# Altium schematic sheet CAP TCH 4xBUT CY8CMBR2044.SchDoc
size 129 x 100 mm
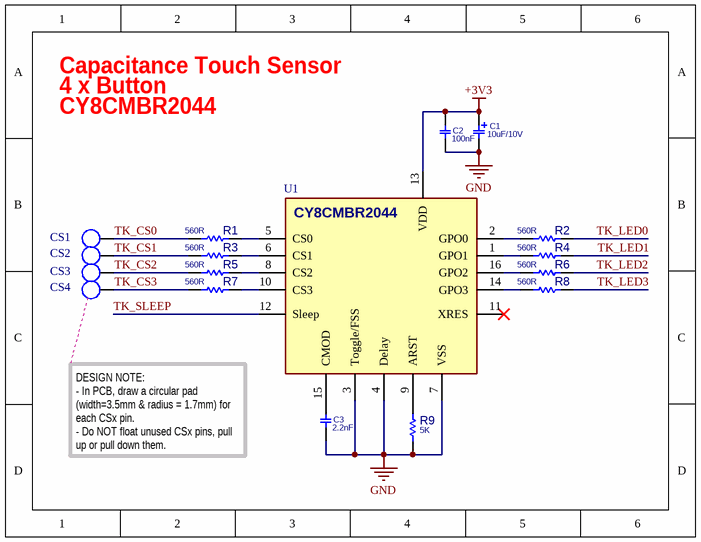
[diagram p0: CAP TCH 4xBUT CY8CMBR2044.SchDoc]

## Parts
C1  10uF/10V  [C_TN_3216]
C2  100nF  [C0603]
C3  2.2nF  [C0603]
CS1  CAP Sense  [CAP Sense 7mm]  (value not drawn)
CS2  CAP Sense  [CAP Sense 7mm]  (value not drawn)
CS3  CAP Sense  [CAP Sense 7mm]  (value not drawn)
CS4  CAP Sense  [CAP Sense 7mm]  (value not drawn)
R1  560R  [R0603]
R2  560R  [R0603]
R3  560R  [R0603]
R4  560R  [R0603]
R5  560R  [R0603]
R6  560R  [R0603]
R7  560R  [R0603]
R8  560R  [R0603]
R9  5K  [R0603]
U1  CY8CMBR2044  [QFN50_16T_3X3]  (value not drawn)

## Nets
+3V3: C1.1 C2.2 U1.13(VDD)
GND: C1.2 C2.1 C3.1 R9.1 U1.3(Toggle/FSS) U1.4(Delay) U1.7(VSS)
TK_CS0: CS1.1 R1.1
TK_CS1: CS2.1 R3.1
TK_CS2: CS3.1 R5.1
TK_CS3: CS4.1 R7.1
TK_LED0: R2.2
TK_LED1: R4.2
TK_LED2: R6.2
TK_LED3: R8.2
TK_SLEEP: U1.12(Sleep)
NetC3_2: C3.2 U1.15(CMOD)
NetR1_2: R1.2 U1.5(CS0)
NetR2_1: R2.1 U1.2(GPO0)
NetR3_2: R3.2 U1.6(CS1)
NetR4_1: R4.1 U1.1(GPO1)
NetR5_2: R5.2 U1.8(CS2)
NetR6_1: R6.1 U1.16(GPO2)
NetR7_2: R7.2 U1.10(CS3)
NetR8_1: R8.1 U1.14(GPO3)
NetR9_2: R9.2 U1.9(ARST)

Not connected (* = marked no-connect by the designer): U1 11(XRES)*

## Notes on the sheet
- Capacitance Touch Sensor
- 4 x Button
- CY8CMBR2044
- (near U1) DESIGN NOTE:
  - In PCB, draw a circular pad (width=3.5mm & radius = 1.7mm) for each CSx pin.
  - Do NOT float unused CSx pins, pull up or pull down them.

## Library data of the parts
C1 = CAP_SMD_TAN: CAP, SMD, TAN; PARAM: 10V; VALUE: 10uF/10V
C2 C3 = CAP_SMD_MLCC: CAP, SMD, MLCC; PARAM: 50V; DESC: CAP, MLCC, 1nF, 50V, C0G, 10%, 0402; MANF_P#: MANF_PART#; MANF: Murata; PARAM2: C0G, 10%; PRICE: 100= 1$; ASSEMBLY: ASSEMBLY
  C2: VALUE: 100nF
  C3: VALUE: 2.2nF
R1-R9 = RES_SMD: RES, SMD; MANF_P#: RK73H1ETTP4701F; MANF: KOA SPEER; PARAM: 0.063W; DESC: DESCRIPTION; DIST#: MOUSER; PARAM2: 1%; ASSEMBLY: ASSEMBLY; PRICE: 100= 0.5$
  R1-R8: VALUE: 560R
  R9: VALUE: 5K
U1 = CY8CMBR2044_QFN16: CapTouchSensor, 4-CH, QFN16; DESC: LED driver open Drain 5v; MANF: Microchip; MANF_P#: CAP1208-1-A4; PARAM2: 3.3/5V; PARAM: 8-CH, I2C/SMBUS, -40~125°C; PRICE: 1$; VALUE: CY8CMBR2044